# Altium schematic sheet PCB_LC_LPF-16-25.SchDoc: LC_LPF-16-20
size A4; DocumentNumber: 1; SheetNumber: 2; SheetTotal: 2
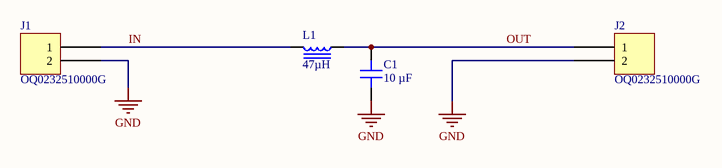
[diagram p0: PCB_LC_LPF-16-25.SchDoc]

## Parts
C1  10 µF  [CAP 0603_1608]
J1  OQ0232510000G  [FCI 06-381-2PIN]
J2  OQ0232510000G  [FCI 06-381-2PIN]
L1  47µH  [IND 0603_1608 RF WW]

## Nets
GND: C1.1 J1.2 J2.2
IN: J1.1 L1.2
OUT: C1.2 J2.1 L1.1

## Notes on the sheet
- DOCUMENT NAME:
- TITLE:
- This document is created by Mitai. Any further questions can be asked through
- AUTHOR :
- REVIEWER:
- Sheet
- PART NO.:
- of
- *
- DATE:
- TEMPLATE:
- team@mitai.ai.
- A4
- Contact Address:Rosenheimer Straße 116b,81669, München.

## Library data of the parts
C1 = MD0603BW106M100NHT-EM: CAP CER 10UF 10V X5R 0603; manufacturer: Knowles Novacap; Tolerance: ±20%; Part Number: MD0603BW106M100NHT-EM; Value: 10 µF; Applications: Medical, Non-Critical; Capacitance: 10 µF; componentlink1description: Datasheet; componentlink1url: https://mm.digikey.com/Volume0/opasdata/d220001/medias/docus/5546/MD Series R3.pdf; componentlink2description: DigiKey Link; componentlink2url: https://www.digikey.com/en/products/detail/knowles-novacap/MD0603BW106M100NHT-EM/21406876; Device Package: 0603 (1608 Metric); lastupdated: 02/11/2023 19:09:18; Lifecycle Status: Active; Minimum Order: 1; Mounting Type: Surface Mount, MLCC; Operating Temperature: -55°C ~ 85°C; Package / Case: 0603 (1608 Metric); packaging: TapeAndReel; partid: 56748; price: 0.24; series: MD; Supplier 1: DigiKey; Supplier Part Number 1: 1763-MD0603BW106M100NHT-EMCT-ND; Temperature Coefficient: X5R; Voltage - Rated: 10V
J1 J2 = OQ0232510000G: TERM BLOCK HDR 2POS 90DEG 3.81MM; Manufacturer: Amphenol Anytek; Current - UL: 10A; Header Orientation: 90°, Right Angle; Number of Levels: 1; Number of Positions: 2; Pitch: 0.150" (3.81mm); Voltage - UL: 300V; Part Number: OQ0232510000G; Color: Green; ComponentLink1Description: Datasheet; ComponentLink1URL: http://portal.fciconnect.com/Comergent//fci/drawing/oqxx32x100j0g.pdf; ComponentLink2Description: DigiKey Link; ComponentLink2URL: //digikey.com/product-detail/en/amphenol-anytek/OQ0232510000G/609-3819-ND/2261255; Contact Mating Finish: Tin; LastUpdated: 16/12/2019 19:14:30; Lifecycle Status: 0; Minimum Order: 1; Mounting Type: Through Hole; Operating Temperature: -40°C ~ 115°C; Packaging: Bulk; Part Status: Active; Positions Per Level: 2; Price: 0.49; Series: 06-381; Supplier 1: DigiKey; Supplier Part Number 1: 609-3819-ND; Termination Style: Solder; Type: Header, Male Pins, Shrouded (4 Side)
L1 = L0603B470MPWFT: INDUCTORPOWER LINE 0603 47H 20%; Manufacturer: KEMET; Current Rating (Amps): 90mA; DC Resistance (DCR): 5.8Ohm; Frequency - Self Resonant: 11MHz; Inductance Frequency - Test: 2.52MHz; Material - Core: Ferrite; Shielding: Unshielded; Type: Wirewound; Part Number: L0603B470MPWFT; ComponentLink1Description: Datasheet; ComponentLink1URL: https://api.kemet.com/component-edge/download/datasheet/L0603B470MPWFT.pdf; ComponentLink2Description: DigiKey Link; ComponentLink2URL: http://digikey.com/product-detail/en/kemet/L0603B470MPWFT/399-17776-1-ND/8601439; Device Package: 0603 (1608 Metric); Height - Seated (Max): 0.035" (0.90mm); Inductance: 47µH; LastUpdated: 06/09/2020 11:05:20; Lifecycle Status: Active; Minimum Order: 1; Mounting Type: Surface Mount; Operating Temperature: -40°C ~ 105°C; Package / Case: 0603 (1608 Metric); Packaging: TapeAndReel; PartId: 1309; Part Status: Active; Price: 0.14; Series: L-PWF; Size / Dimension: 0.063" L x 0.031" W (1.60mm x 0.80mm); Supplier 1: DigiKey; Supplier Part Number 1: 399-17776-1-ND; Supplier Device Package: 0603 (1608 Metric); Tolerance: ±20%; Value: 47µH